# Altium schematic sheet NRF24l01.SchDoc
size A
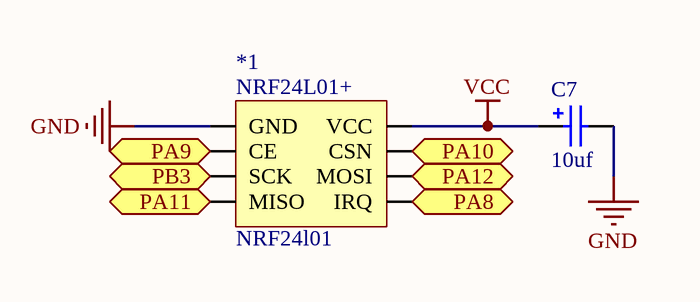
[diagram p0: NRF24l01.SchDoc]

## Parts
*1  NRF24l01  [NRF24l01]
C7  10uf  [SMD-0805C]

## Ports
PA8, PA9, PA10, PA11, PA12, PB3

## Nets
GND: *1.1(GND) C7.2
VCC: *1.2(VCC) C7.1
PA8: *1.8(IRQ) ; port PA8
PA9: *1.3(CE) ; port PA9
PA10: *1.4(CSN) ; port PA10
PA11: *1.7(MISO) ; port PA11
PA12: *1.6(MOSI) ; port PA12
PB3: *1.5(SCK) ; port PB3

## Notes on the sheet
- (in symbol NRF24l01) NRF24L01+

## Library data of the parts
C7 = EKA00AA247F00: Aluminum Electrolytic Capacitor, Radial Style with Long Leads: 47uF, 35V; Note: Refer to Manufacturer's Data Sheets for other lead formations; DrillSize: Nominal, Rounded To The Nearest 0.1mm; Published: 19-Mar-2004; DatasheetDocument: 20-Feb-2001; PackageReference: CAPPR2-5X11; Publisher: Altium Limited; ComponentLink1Description: Manufacturer Link; ComponentLink1URL: http://www.vishay.com/; ComponentLink2Description: Datasheet; ComponentLink2URL: http://www.vishay.com/docs/25014/eka.pdf; Value: 10uF